# EasyEDA Pro project CameraSmartWatch.eprj

# Schematic Schematic1
Create Date: 2023-10-17; Page Name: P1; Project Name: CameraSmartWatch; Schematic Name: Schematic1; Update Date: 2023-11-03; Company: JoaoMiranda; Drawed: Ramiro Seliman; Page Size: A4; Part Number: PARTE 1; Reviewed: Ramiro Seliman; Version: V0.1
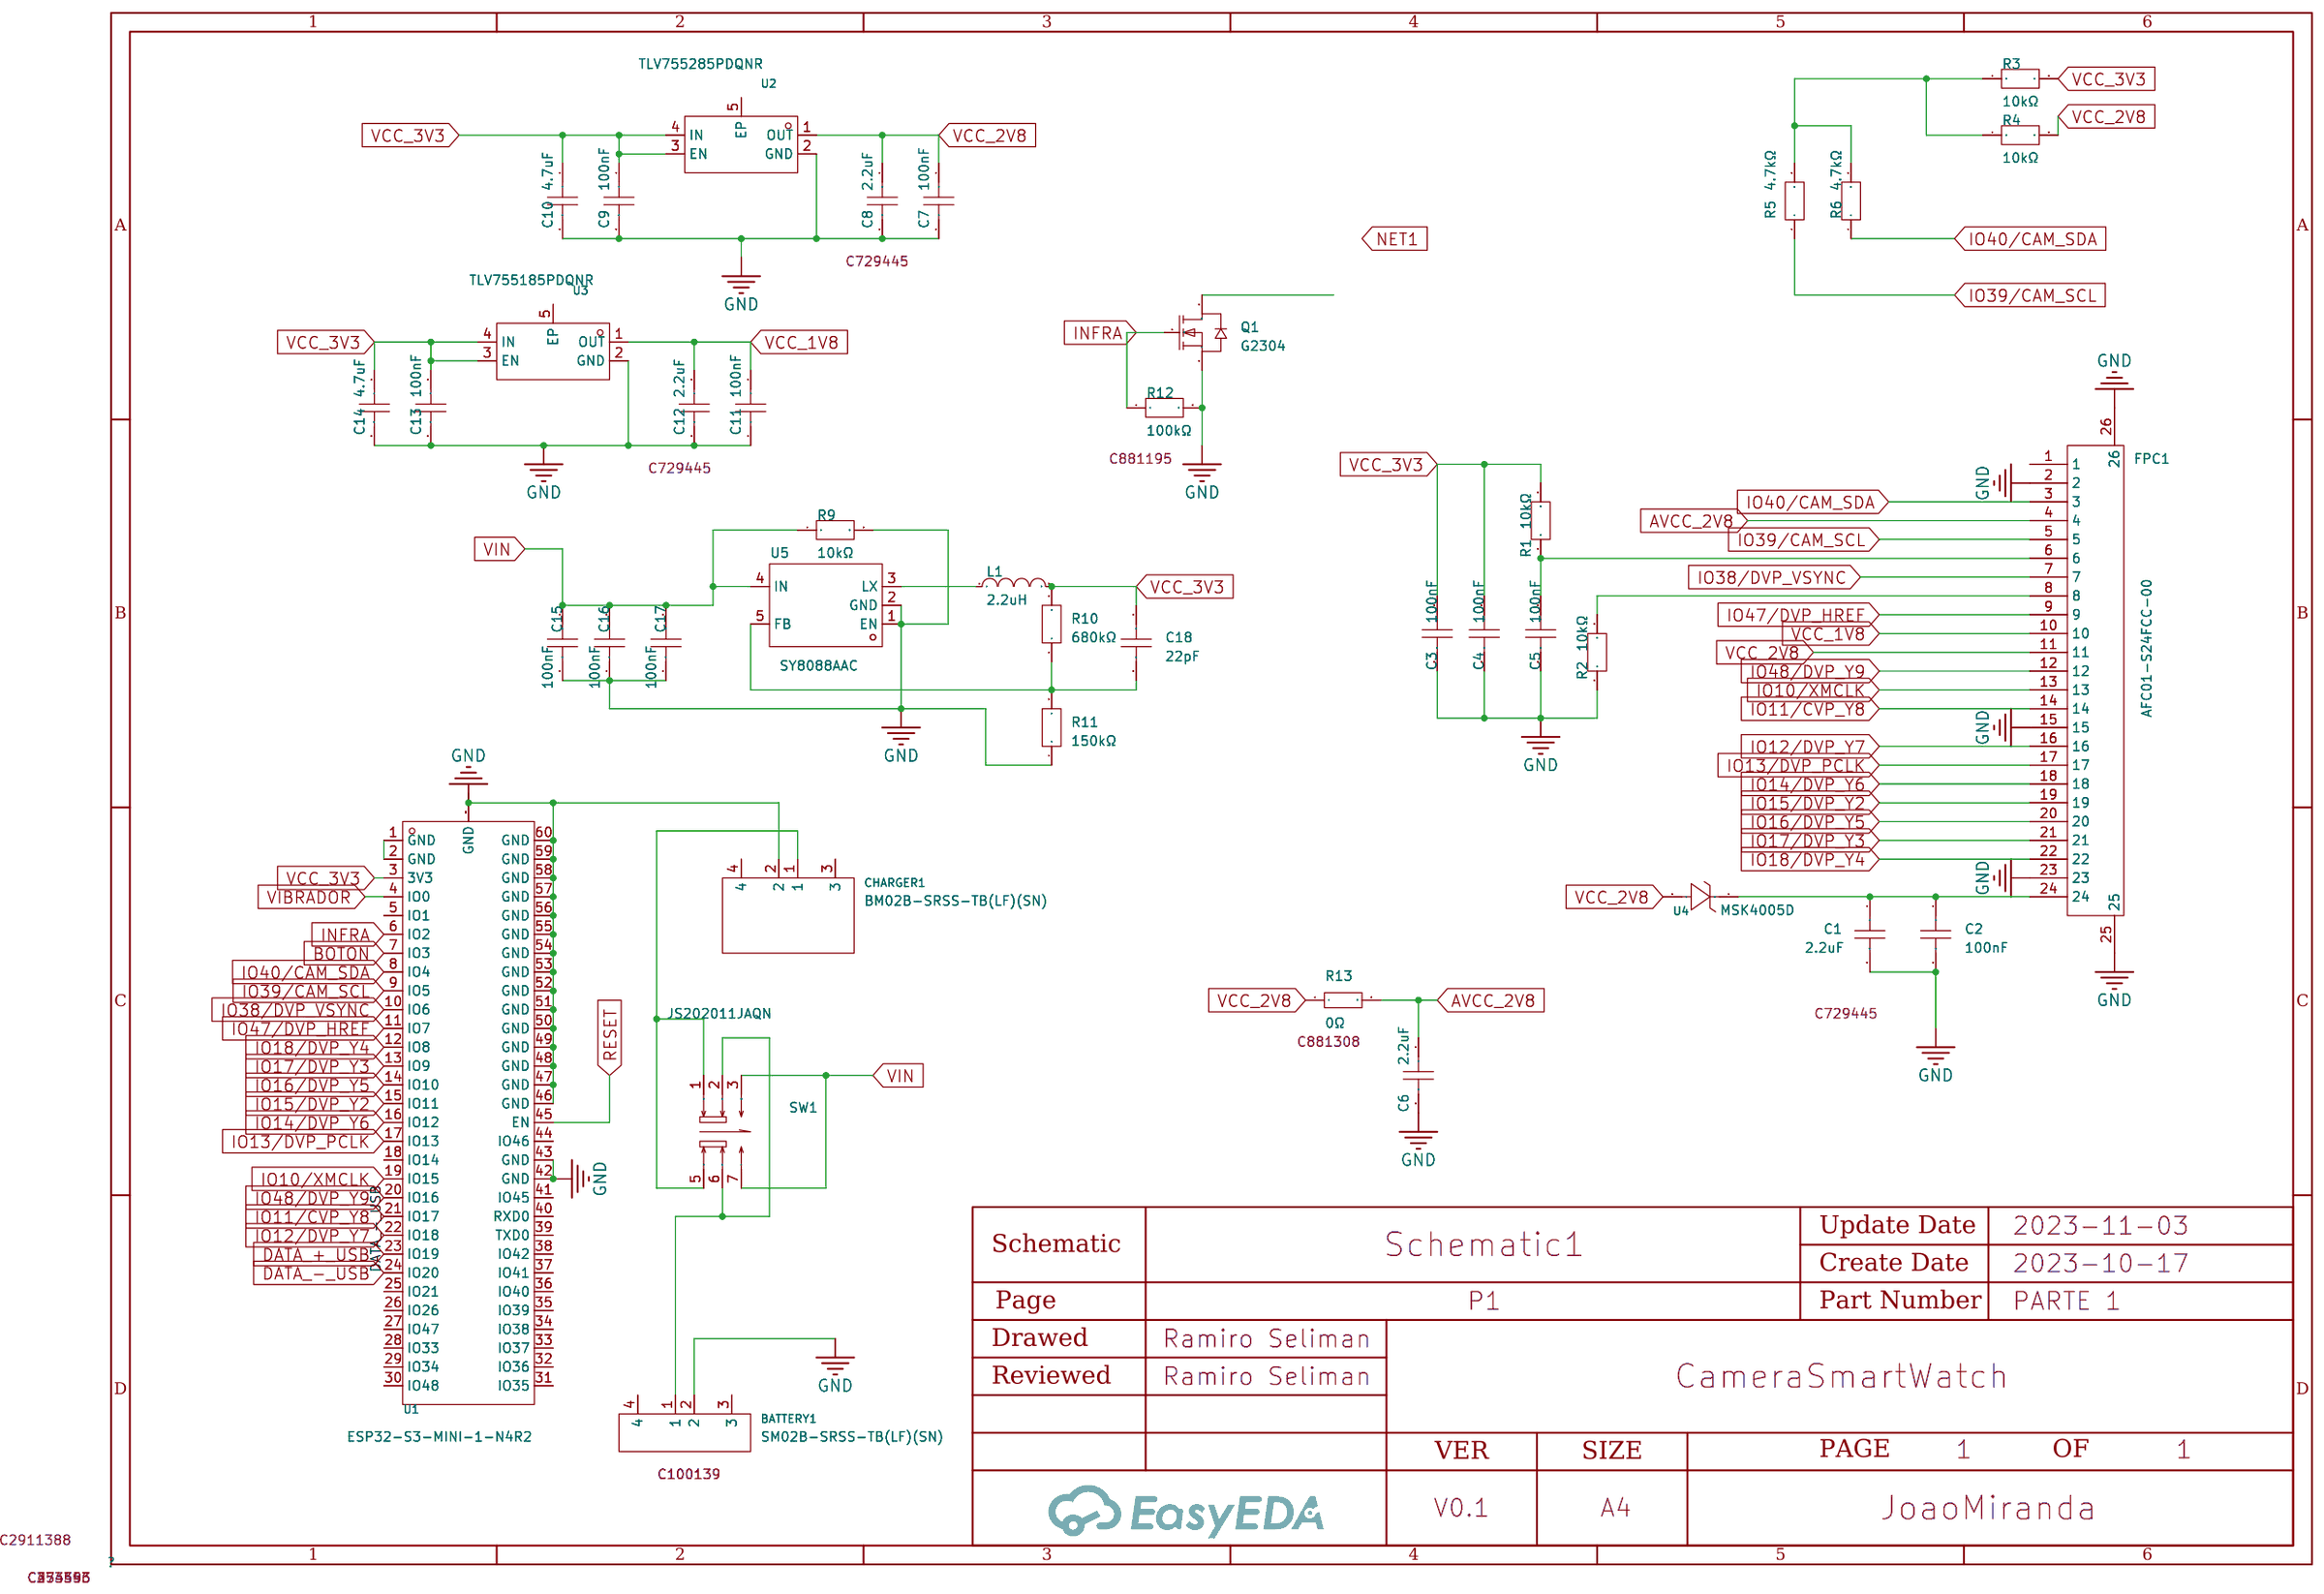
[diagram p0: schematic sheet]

## Parts
BATTERY1  SM02B-SRSS-TB(LF)(SN)  [CONN-SMD_2P-P1.00_SM02B-SRSS-TB-LF-SN]
C1  2.2uF  [C0201]
C2  100nF  [C0201]
C3  100nF  [C0201]
C4  100nF  [C0201]
C5  100nF  [C0201]
C6  2.2uF  [C0201]
C7  100nF  [C0201]
C8  2.2uF  [C0201]
C9  100nF  [C0201]
C10  4.7uF  [C0402]
C11  100nF  [C0201]
C12  2.2uF  [C0201]
C13  100nF  [C0201]
C14  4.7uF  [C0402]
C15  100nF  [C0201]
C16  100nF  [C0201]
C17  100nF  [C0201]
C18  22pF  [C0201]
CHARGER1  BM02B-SRSS-TB(LF)(SN)  [CONN-TH_BM02B-SRSS-TB-LF-SN]
FPC1  AFC01-S24FCC-00  [FPC-SMD_P0.5-24P_FGS-XJ-H2.0]
L1  2.2uH  [IND-SMD_L2.5-W2.0_YXNAQ2520XX]
Q1  G2304  [SOT-23-3_L2.9-W1.3-P1.90-LS2.4-BR]
R1  10kΩ  [R0201]
R2  10kΩ  [R0201]
R3  10kΩ  [R0201]
R4  10kΩ  [R0201]
R5  4.7kΩ  [R0201]
R6  4.7kΩ  [R0201]
R9  10kΩ  [R0201]
R10  680kΩ  [R0201]
R11  150kΩ  [R0201]
R12  100kΩ  [R0201]
R13  0Ω  [R0603]
SW1  JS202011JAQN  [SW-SMD_JS202011JAQN]
U1  ESP32-S3-MINI-1-N4R2  [BULETM-SMD_ESP32-S3-MINI-1-N8]
U2  TLV755285PDQNR  [X2SON-4_L1.0-W1.0-P0.65-TL-EP]
U3  TLV755185PDQNR  [X2SON-4_L1.0-W1.0-P0.65-TL-EP]
U4  MSK4005D  [SOD-882_L1.0-W0.6-RD]
U5  SY8088AAC  [SOT-23-5_L3.0-W1.7-P0.95-LS2.8-BR]

## Library data of the parts
BATTERY1 = SM02B-SRSS-TB(LF)(SN): Pitch:1mm Number of Rows:1 Mounting Style:Surface Mount Current Rating (Max):1A Contact Material:Copper Alloy Contact Plating:Tin Operating Temperature Range:-25℃~+85℃ Operating Temperature Range:-25℃~+85℃; LCSC Part Name: 间距:1mm 卧贴; Supplier Part: C160402; Manufacturer: JST; JLCPCB Part Class: Extended Part; Datasheet: https://atta.szlcsc.com/upload/public/pdf/source/20181010/C265335_7D2AD766CA0E20E745663C87507A223E.pdf; Supplier: LCSC; Pitch: 1mm; Number of Rows: 1; Mounting Style: Surface Mount; Current Rating (Max): 1A; Contact Material: Copper Alloy; Contact Plating: Tin; Operating Temperature Range: -25℃~+85℃
C1 C6 C8 C12 = C0201X5R225M100NT: Capacitance: Tolerance:±20% Tolerance:±20% Voltage Rated: Temperature Coefficient:; LCSC Part Name: 2.2uF ±20% 10V; Supplier Part: C729445; Manufacturer: SANYEAR(叁叶源); Supplier Footprint: 0201; JLCPCB Part Class: Extended Part; Datasheet: https://atta.szlcsc.com/upload/public/pdf/source/20200102/C475251_1E30ECAC0E8AE7254982658A02A2D78C.pdf; Supplier: LCSC; Tolerance: ±20%
C2-C5 C7 C9 C11 C13 C15-C17 = C0201B104K016TSF: Capacitance: Tolerance:±10% Tolerance:±10% Voltage Rated: Temperature Coefficient:; LCSC Part Name: 100nF ±10% 16V; Supplier Part: C559124; Manufacturer: IHHEC(禾伸堂); Supplier Footprint: 0201; JLCPCB Part Class: Extended Part; Datasheet: https://atta.szlcsc.com/upload/public/pdf/source/20200702/C559124_E602A2AD591ED344AFA764914E67FE0D.pdf; Supplier: LCSC; Tolerance: ±10%
C10 C14 = C0402X5R475M250NT: Capacitance: Voltage Rated: Temperature Coefficient:; LCSC Part Name: 4.7uF 25V; Supplier Part: C2911388; Manufacturer: SANYEAR(叁叶源); Supplier Footprint: 0402; JLCPCB Part Class: Extended Part; Datasheet: https://atta.szlcsc.com/upload/public/pdf/source/20210902/8F39E0658D363F48630A7672568BDC14.pdf; Supplier: LCSC; Check: true
C18 = CC0201FRNPO8BN220: Capacitance: Voltage Rated: Temperature Coefficient:; LCSC Part Name: 22pF 25V; Supplier Part: C541256; Manufacturer: YAGEO(国巨); Supplier Footprint: 0201; JLCPCB Part Class: Extended Part; Datasheet: https://atta.szlcsc.com/upload/public/pdf/source/20200615/C541256_B8D9E0562C8FB5CDBFC350BE07B53858.pdf; Supplier: LCSC
CHARGER1 = BM02B-SRSS-TB(LF)(SN): Pitch:1mm Number of Rows:1 Mounting Style:Surface Mount Current Rating (Max):1A Contact Material:Copper Alloy Contact Plating:Tin Operating Temperature Range:-25℃~+85℃ Operating Temperature Range:-25℃~+85℃; Supplier Part: C160388; Manufacturer: JST; Supplier Footprint: SMD,P=1mm; JLCPCB Part Class: Extended Part; Datasheet: https://atta.szlcsc.com/upload/public/pdf/source/20181008/C268118_5C0FE2784716D1E5DD0A36233D1E1F34.pdf; Supplier: LCSC; Pitch: 1mm; Number of Rows: 1; Mounting Style: Surface Mount; Current Rating (Max): 1A; Contact Material: Copper Alloy; Contact Plating: Tin; Operating Temperature Range: -25℃~+85℃
FPC1 = AFC01-S24FCC-00: Pitch:0.5mm Number of Contacts:24P Locking Feature:Clamshell Mounting Type:Surface Mount Contact Type:Bottom Contact Height Above Board:2mm FFC, FCB Thickness:0.3mm~0.3mm FFC, FCB Thickness:0.3mm~0.3mm; LCSC Part Name: 0.5mm P数:24P 翻盖式 下接; Supplier Part: C262276; Manufacturer: JS(钜硕电子); Supplier Footprint: SMD,P=0.5mm; JLCPCB Part Class: Extended Part; Datasheet: https://atta.szlcsc.com/upload/public/pdf/source/20190816/C413942_2A72D1AC756EAE17EEDF756A339D4500.pdf; Supplier: LCSC; Pitch: 0.5mm; Number of Contacts: 24P; Locking Feature: Clamshell; Mounting Type: Surface Mount; Contact Type: Bottom Contact; Height Above Board: 2mm; FFC, FCB Thickness: 0.3mm~0.3mm
L1 = CKCS252012-2.2uH/N: Inductance: Tolerance:±30% Tolerance:±30% Rated Current: DC Resistance (DCR):; LCSC Part Name: 2.2uH ±30% 1.15A 216mΩ; Supplier Part: C354553; Manufacturer: CENKER(岑科); Supplier Footprint: SMD; JLCPCB Part Class: Extended Part; Datasheet: https://atta.szlcsc.com/upload/public/pdf/source/20190115/C354553_DA469E714C0072E4D484EF553D127654.pdf; Supplier: LCSC; Tolerance: ±30%
Q1 = G2304: Type: Drain Source Voltage (Vdss): Continuous Drain Current (Id): Power Dissipation (Pd): Drain Source On Resistance (RDS(on)@Vgs,Id):58mΩ@10A,3.6A Gate Threshold Voltage (Vgs(th)@Id):2.2V@250uA; LCSC Part Name: N沟道 30V 3.6A; Supplier Part: C337503; Manufacturer: GOFORD(谷峰); Supplier Footprint: SOT-23; JLCPCB Part Class: Extended Part; Datasheet: https://atta.szlcsc.com/upload/public/pdf/source/20181128/C337503_FF6985BF364290258D92D50176B96B42.pdf; Supplier: LCSC; Drain Source On Resistance (RDS(on)@Vgs,Id): 58mΩ@10A,3.6A; Gate Threshold Voltage (Vgs(th)@Id): 2.2V@250uA
R1-R4 R9 = CR0201FH1002G: Type: Resistance: Tolerance:±1% Tolerance:±1% Power(Watts):- Overload Voltage (Max):-; LCSC Part Name: 10kΩ ±1%; Supplier Part: C100126; Manufacturer: LIZ(丽智电子); Supplier Footprint: 0201; JLCPCB Part Class: Extended Part; Datasheet: https://atta.szlcsc.com/upload/public/pdf/source/20170408/1491621348608.pdf; Supplier: LCSC; Tolerance: ±1%
R5 R6 = CR0201FH4701G: Type:Thick Film Resistors Resistance: Tolerance:±1% Tolerance:±1% Power(Watts): Temperature Coefficient:±250ppm/℃ Temperature Coefficient:±250ppm/℃ Overload Voltage (Max): Operating Temperature Range:-55℃~+125℃ Operating Temperature Range:-55℃~+125℃; LCSC Part Name: 4.7kΩ ±1% 50mW; Supplier Part: C100139; Manufacturer: LIZ(丽智电子); Supplier Footprint: 0201; JLCPCB Part Class: Extended Part; Datasheet: https://atta.szlcsc.com/upload/public/pdf/source/20170408/1491621352521.pdf; Supplier: LCSC; Type: Thick Film Resistors; Tolerance: ±1%; Temperature Coefficient: ±250ppm/℃; Operating Temperature Range: -55℃~+125℃
R10 = 0201WMF6803TEE: Type:Thick Film Resistors Resistance: Tolerance:±1% Tolerance:±1% Power(Watts): Temperature Coefficient:±200ppm/℃ Temperature Coefficient:±200ppm/℃ Overload Voltage (Max): Operating Temperature Range:-55℃~+155℃ Operating Temperature Range:-55℃~+155℃; LCSC Part Name: 680kΩ ±1% 50mW; Supplier Part: C473493; Manufacturer: UNI-ROYAL(厚声); Supplier Footprint: 0201; JLCPCB Part Class: Extended Part; Datasheet: https://atta.szlcsc.com/upload/public/pdf/source/20200306/C422600_1E6D84923E4A46A82E41ADD87F860B5C.pdf; Supplier: LCSC; Type: Thick Film Resistors; Tolerance: ±1%; Temperature Coefficient: ±200ppm/℃; Operating Temperature Range: -55℃~+155℃
R11 = RC0201FR-07150KL: Type:Thick Film Resistors Resistance: Tolerance:±1% Tolerance:±1% Power(Watts): Temperature Coefficient:±200ppm/℃ Temperature Coefficient:±200ppm/℃ Overload Voltage (Max): Operating Temperature Range:-55℃~+125℃ Operating Temperature Range:-55℃~+125℃; LCSC Part Name: 厚膜电阻 150kΩ ±1% 50mW; Supplier Part: C274346; Manufacturer: YAGEO(国巨); Supplier Footprint: 0201; JLCPCB Part Class: Extended Part; Datasheet: https://atta.szlcsc.com/upload/public/pdf/source/20180821/C275644_0D56F95EFF785E7D9A1FEF436B37DA78.pdf; Supplier: LCSC; Type: Thick Film Resistors; Tolerance: ±1%; Temperature Coefficient: ±200ppm/℃; Operating Temperature Range: -55℃~+125℃
R12 = CR0201J100KQ15Z: Resistance: Tolerance:±5% Tolerance:±5% Power(Watts): Temperature Coefficient:±200ppm/℃ Temperature Coefficient:±200ppm/℃; LCSC Part Name: 100kΩ ±5% 50mW; Supplier Part: C881195; Manufacturer: EVER OHMS(天二科技); Supplier Footprint: 0201; JLCPCB Part Class: Extended Part; Datasheet: https://atta.szlcsc.com/upload/public/pdf/source/20201014/C881429_ABC29D63C8D6A11EB63D87348B25AA7B.pdf; Supplier: LCSC; Tolerance: ±5%; Temperature Coefficient: ±200ppm/℃
R13 = CR0603F0R00P05Z: Resistance: Tolerance:±1% Tolerance:±1% Power(Watts):; LCSC Part Name: 0Ω ±1% 100mW; Supplier Part: C881308; Manufacturer: EVER OHMS(天二科技); Supplier Footprint: 0603; JLCPCB Part Class: Extended Part; Datasheet: https://atta.szlcsc.com/upload/public/pdf/source/20201014/C881429_ABC29D63C8D6A11EB63D87348B25AA7B.pdf; Supplier: LCSC; Tolerance: ±1%
SW1 = JS202011JAQN: Current Rating (DC):300mA Voltage Rating (DC):6V Current Rating (AC):- Voltage Rating (AC):- Circuit:DPDT Mounting Style:Surface Mount Mechanical Life:5000 Actuator Style:Rectangular columnar Pin Style:J pin Operating Temperature:-40℃~+85℃ Operating Tempe; Supplier Part: C221664; Manufacturer: C&K; Supplier Footprint: SMD; JLCPCB Part Class: Extended Part; Datasheet: https://atta.szlcsc.com/upload/public/pdf/source/20180724/C221664_88647708B2CCDCC34936E1CD4FA56A87.pdf; Supplier: LCSC; Current Rating (DC): 300mA; Voltage Rating (DC): 6V; Circuit: DPDT; Mounting Style: Surface Mount; Mechanical Life: 5000; Actuator Style: Rectangular columnar; Pin Style: J pin; Operating Temperature: -40℃~+85℃
U1 = ESP32-S3-MINI-1-N4R2: Supplier Part: C3013941; Manufacturer: ESPRESSIF(乐鑫); Supplier Footprint: SMD; JLCPCB Part Class: Extended Part; Supplier: LCSC
U2 = SGM2036S-2.8XXDH4G/TR: Supplier Part: C2860936; Manufacturer: TI(德州仪器); Supplier Footprint: XTDFN-4L(1x1); Datasheet: https://atta.szlcsc.com/upload/public/pdf/source/20220622/ACAD10DFD97B58DF70C689B3412109D4.pdf; Supplier: LCSC
U3 = TLV755185PDQNR: Supplier Part: C2860936; Manufacturer: TI(德州仪器); Supplier Footprint: X2-SON-4-EP(1x1); JLCPCB Part Class: Extended Part; Datasheet: https://atta.szlcsc.com/upload/public/pdf/source/20230221/8E16F3B2F32D2FF7008DD79494891D4F.pdf; Supplier: LCSC
U4 = MSK4005D: Diode Configuration:Single Reverse Voltage (Vr):40V Average Rectified Current (Io):0.5A Forward Voltage (Vf@If):0.52V Reverse Leakage Current (Ir):50uA; LCSC Part Name: 40V 500mA 520mV; Supplier Part: C5160066; Manufacturer: SHIKUES(时科); Supplier Footprint: SOD-882; JLCPCB Part Class: Extended Part; Datasheet: https://atta.szlcsc.com/upload/public/pdf/source/20220908/AAA04C124F860CBF6FF51CBCA68291D9.pdf; Supplier: LCSC; Diode Configuration: Single; Reverse Voltage (Vr): 40V; Average Rectified Current (Io): 0.5A; Forward Voltage (Vf@If): 0.52V; Reverse Leakage Current (Ir): 50uA
U5 = SY8088AAC: Function:Step-down type Synchronous Rectification:- Number of Outputs:- Topology:- Input Voltage:- Input Voltage:- Output Current (Max):- Switching Frequency:-; LCSC Part Name: 降压型; Supplier Part: C79313; Manufacturer: silergy(矽力杰); Supplier Footprint: SOT-23-5; JLCPCB Part Class: Extended Part; Datasheet: https://atta.szlcsc.com/upload/public/pdf/source/20170329/1490752163260.pdf; Supplier: LCSC; Function: Step-down type

## Nets
AVCC_2V8: C6.1 FPC1.4 R13.2
GND: BATTERY1.2 C1.2 C2.2 C3.2 C4.2 C5.2 C6.2 C7.2 C8.2 C9.2 C10.2 C11.2 C12.2 C13.2 C14.2 C15.2 C16.1 C17.1 CHARGER1.2 FPC1.2 FPC1.15 FPC1.23 FPC1.25 FPC1.26 Q1.2(S) R2.1 R9.2 R11.1 R12.2 U1.42(GND) U1.43(GND) U1.46(GND) U1.47(GND) U1.48(GND) U1.49(GND) U1.50(GND) U1.51(GND) U1.52(GND) U1.53(GND) U1.54(GND) U1.55(GND) U1.56(GND) U1.57(GND) U1.58(GND) U1.59(GND) U1.60(GND) U1.GND U2.2(GND) U3.2(GND) U5.1(EN) U5.2(GND)
VCC_1V8: C11.1 C12.1 FPC1.10 U3.1(OUT)
VCC_2V8: C7.1 C8.1 FPC1.11 R4.2 R13.1 U2.1(OUT) U4.2(A)
VCC_3V3: C3.1 C4.1 C9.1 C10.1 C13.1 C14.1 C18.1 L1.2 R1.2 R3.2 R10.2 U1.3(3V3) U2.3(EN) U2.4(IN) U3.3(EN) U3.4(IN)
VIN: C15.1 C16.2 C17.2 R9.1 SW1.3 SW1.7 U5.4(IN)
BOTON: U1.7(IO3)
DATA_+_USB: U1.23(IO19)
DATA_-_USB: U1.24(IO20)
INFRA: Q1.1(G) R12.1 U1.6(IO2)
IO10/XMCLK: FPC1.13 U1.19(IO15)
IO11/CVP_Y8: FPC1.14 U1.21(IO17)
IO12/DVP_Y7: FPC1.16 U1.22(IO18)
IO13/DVP_PCLK: FPC1.17 U1.17(IO13)
IO14/DVP_Y6: FPC1.18 U1.16(IO12)
IO15/DVP_Y2: FPC1.19 U1.15(IO11)
IO16/DVP_Y5: FPC1.20 U1.14(IO10)
IO17/DVP_Y3: FPC1.21 U1.13(IO9)
IO18/DVP_Y4: FPC1.22 U1.12(IO8)
IO38/DVP_VSYNC: FPC1.7 U1.10(IO6)
IO39/CAM_SCL: FPC1.5 R5.1 U1.9(IO5)
IO40/CAM_SDA: FPC1.3 R6.1 U1.8(IO4)
IO47/DVP_HREF: FPC1.9 U1.11(IO7)
IO48/DVP_Y9: FPC1.12 U1.20(IO16)
RESET: U1.45(EN)
VIBRADOR: U1.4(IO0)
$1N1431: C1.1 C2.1 FPC1.24 U4.1(K)
$1N1711: C5.1 FPC1.6 R1.1
$1N1779: FPC1.8 R2.2
$1N2040: R3.1 R4.1 R5.2 R6.2
$1N3684: U1.1(GND) U1.2(GND)
$1N9477: BATTERY1.1 SW1.2 SW1.6
$1N11625: L1.1 U5.3(LX)
$1N11783: C18.2 R10.1 R11.2 U5.5(FB)
$1N23339: CHARGER1.1 SW1.1 SW1.5

Not connected (* = marked no-connect by the designer): BATTERY1 3 4; CHARGER1 3 4; FPC1 1; Q1 3(D); U1 5(IO1) 18(IO14) 25(IO21) 26(IO26) 27(IO47) 28(IO33) 29(IO34) 30(IO48) 31(IO35) 32(IO36) 33(IO37) 34(IO38) 35(IO39) 36(IO40) 37(IO41) 38(IO42) 39(TXD0) 40(RXD0) 41(IO45) 44(IO46); U2 5(EP); U3 5(EP)

# Board PCB1
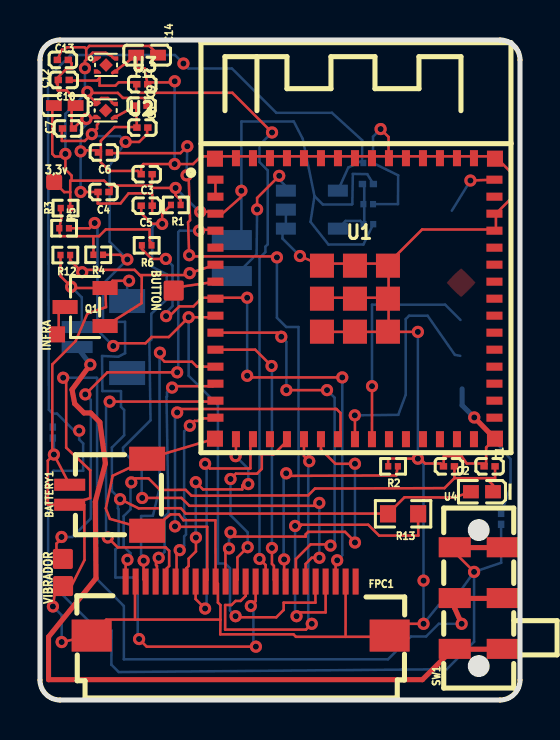
[diagram p1: board, top side]
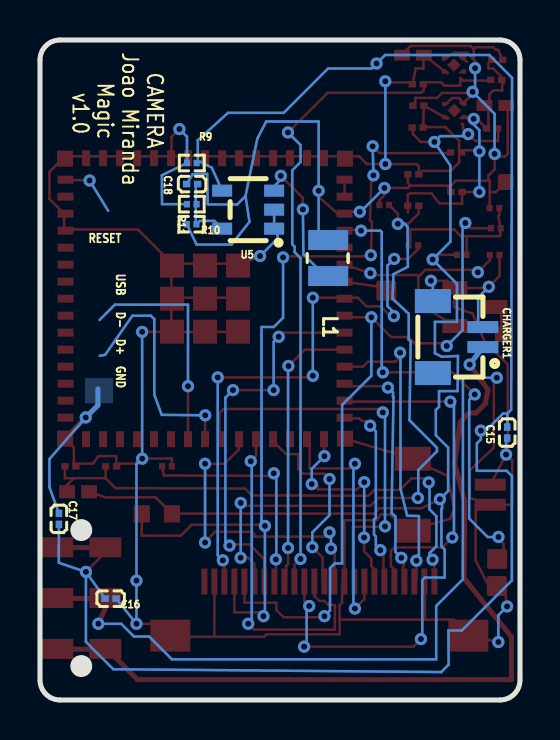
[diagram p2: board, bottom side, seen from below]

Outline 24 x 33 mm; copper layers: Top Layer, Bottom Layer. Coordinates in mm from the lower left corner of the outline.
Outline path: 0,32 0,1 arc(0.29,0.29) 1,0 23,0 arc(23.71,0.29) 24,1 24,32 arc(23.71,32.71) 23,33 1,33 arc(0.29,32.71) 0,32
Stack: Top Layer 0.035mm / Dielectric1 1.51mm FR4 er 4.5 / Bottom Layer 0.035mm

## Design rules (mm)
template: Custom Config
spacing copperThickness1oz (default): track to track 0.102, other pairs 0.152 to 0.3
spacing copperThickness2oz: track to track 0.203, other pairs 0.152 to 0.3
track width copperThickness1oz (default): min 0.127, default 0.127, max 2.54
track width copperThickness2oz: min 0.203, default 0.254, max 2.54
differential pair differentialPair (default): width min 0.127, default 0.254, max 2.54; gap min 0.152, default 0.152
via viaSize (default): diameter min 0.5, default 0.61, max 10; hole min 0.3, default 0.305, max 6.3

## Placement (name value [footprint] x y rotation side)
BATTERY1  SM02B-SRSS-TB(LF)(SN)  [CONN-SMD_2P-P1.00_SM02B-SRSS-TB-LF-SN]  3.42 10.26 90 top
C1  2.2uF  [C0201]  22.48 11.68 180 top
C2  100nF  [C0201]  20.45 11.68 180 top
C3  100nF  [C0201]  5.33 26.29 180 top
C4  100nF  [C0201]  3.18 25.4 180 top
C5  100nF  [C0201]  5.34 24.71 0 top
C6  2.2uF  [C0201]  3.19 27.38 180 top
C7  100nF  [C0201]  1.4 28.58 0 top
C8  2.2uF  [C0201]  5.12 28.62 180 top
C9  100nF  [C0201]  5.08 29.72 180 top
C10  4.7uF  [C0402]  1.24 29.72 0 top
C11  100nF  [C0201]  5.11 30.79 0 top
C12  2.2uF  [C0201]  1.19 31 180 top
C13  100nF  [C0201]  1.14 32 0 top
C14  4.7uF  [C0402]  5.36 32.24 180 top
C15  100nF  [C0201]  0.64 13.37 270 bottom
C16  100nF  [C0201]  20.47 5.07 0 bottom
C17  100nF  [C0201]  23.05 9.06 270 bottom
C18  22pF  [C0201]  16.4 25.8 180 bottom
CHARGER1  BM02B-SRSS-TB(LF)(SN)  [CONN-TH_BM02B-SRSS-TB-LF-SN]  3.11 18.15 270 bottom
FPC1  AFC01-S24FCC-00  [FPC-SMD_P0.5-24P_FGS-XJ-H2.0]  10.03 4.57 180 top
L1  2.2uH  [IND-SMD_L2.5-W2.0_YXNAQ2520XX]  9.59 22.1 90 bottom
NOREF  -  [Pad_e154]  0.71 25.9 90 top
NOREF#2  -  [Pad_e1959]  6.68 20.47 0 top
NOREF#3  -  [Pad_e140]  0.85 18.28 90 top
NOREF#4  -  [Pad_e155]  1.16 5.7 270 top
NOREF#5  -  [Pad_e158]  1.14 7.05 270 top
Q1  G2304  [sot-23-3_l2.9-w1.3-p1.90-ls2.4-br]  2.25 19.65 0 top
R1  10kΩ  [R0201]  6.79 24.75 0 top
R2  10kΩ  [R0201]  17.65 11.68 0 top
R3  10kΩ  [R0201]  1.28 24.59 0 top
R4  10kΩ  [R0201]  2.91 22.26 0 top
R5  4.7kΩ  [R0201]  1.21 23.59 180 top
R6  4.7kΩ  [R0201]  5.33 22.73 0 top
R9  10kΩ  [R0201]  16.41 26.85 0 bottom
R10  680kΩ  [R0201]  16.42 23.79 0 bottom
R11  150kΩ  [R0201]  16.41 24.79 180 bottom
R12  100kΩ  [R0201]  1.27 22.25 180 top
R13  0Ω  [R0603]  18.16 9.31 0 top
SW1  JS202011JAQN  [SW-SMD_JS202011JAQN]  21.94 5.1 90 top
U1  ESP32-S3-MINI-1-N4R2  [BULETM-SMD_ESP32-S3-MINI-1-N8]  15.75 20.07 0 top
U2  TLV755285PDQNR  [X2SON-4_L1.0-W1.0-P0.65-TL-EP]  3.28 29.47 0 top
U3  TLV755185PDQNR  [X2SON-4_L1.0-W1.0-P0.65-TL-EP]  3.3 31.75 0 top
U4  MSK4005D  [SOD-882_L1.0-W0.6-RD]  22.1 10.41 180 top
U5  SY8088AAC  [SOT-23-5_L3.0-W1.7-P0.95-LS2.8-BR]  13.59 24.52 180 bottom

## Footprints (pads in the part's own frame, mm; a bottom-side part is the same pattern mirrored in y, then rotated)
BULETM-SMD_ESP32-S3-MINI-1-N8
  rect 0.8x0.4 smd: 1(-6.975,5.95) 2(-6.975,5.1) 3(-6.975,4.25) 4(-6.975,3.4) 5(-6.975,2.55) 6(-6.975,1.7) 7(-6.975,0.85) 8(-6.975,0) 9(-6.975,-0.85) 10(-6.975,-1.7) 11(-6.975,-2.55) 12(-6.975,-3.4) 13(-6.975,-4.25) 14(-6.975,-5.1) 15(-6.975,-5.95) 31(6.975,-5.95) 32(6.975,-5.1) 33(6.975,-4.25) 34(6.975,-3.4) 35(6.975,-2.55) 36(6.975,-1.7) 37(6.975,-0.85) 38(6.975,0) 39(6.975,0.85) 40(6.975,1.7) 41(6.975,2.55) 42(6.975,3.4) 43(6.975,4.25) 44(6.975,5.1) 45(6.975,5.95)
  rect 0.4x0.8 smd: 16(-5.95,-7.025) 17(-5.1,-7.025) 18(-4.25,-7.025) 19(-3.4,-7.025) 20(-2.55,-7.025) 21(-1.7,-7.025) 22(-0.85,-7.025) 23(0,-7.025) 24(0.85,-7.025) 25(1.7,-7.025) 26(2.55,-7.025) 27(3.4,-7.025) 28(4.25,-7.025) 29(5.1,-7.025) 30(5.95,-7.025) 46(5.95,7.025) 47(5.1,7.025) 48(4.25,7.025) 49(3.4,7.025) 50(2.55,7.025) 51(1.7,7.025) 52(0.85,7.025) 53(0,7.025) 54(-0.85,7.025) 55(-1.7,7.025) 56(-2.55,7.025) 57(-3.4,7.025) 58(-4.25,7.025) 59(-5.1,7.025) 60(-5.95,7.025)
  rect 0.8x0.8 smd: GND(-7,7) GND(-7,-7) GND(7,7) GND(7,-7)
  rect 1.2x1.2 smd: GND(-1.65,1.65) GND(-1.65,0) GND(-1.65,-1.65) GND(0,1.65) GND(0,0) GND(0,-1.65) GND(1.65,1.65) GND(1.65,0) GND(1.65,-1.65)
C0201
  rect 0.368x0.324 smd: 1(-0.275,0) 2(0.275,0)
C0402
  rect 0.79x0.54 smd: 1(-0.545,0) 2(0.545,0)
CONN-SMD_2P-P1.00_SM02B-SRSS-TB-LF-SN
  rect 0.6x1.55 smd: 1(-0.5,1.938) 2(0.5,1.938)
  rect 1.2x1.8 smd: 3(1.8,-1.938) 4(-1.8,-1.938)
CONN-TH_BM02B-SRSS-TB-LF-SN
  rect 0.6x1.55 smd: 1(0.502,1.25) 2(-0.498,1.25)
  rect 1.2x1.8 smd: 3(1.8,-1.25) 4(-1.8,-1.25)
FPC-SMD_P0.5-24P_FGS-XJ-H2.0
  rect 0.3x1.3 smd: 1(-5.748,-1.351) 2(-5.248,-1.351) 3(-4.748,-1.351) 4(-4.248,-1.351) 5(-3.748,-1.351) 6(-3.248,-1.351) 7(-2.748,-1.351) 8(-2.248,-1.351) 9(-1.748,-1.351) 10(-1.248,-1.351) 11(-0.748,-1.351) 12(-0.248,-1.351) 13(0.252,-1.351) 14(0.752,-1.351) 15(1.252,-1.351) 16(1.752,-1.351) 17(2.252,-1.351) 18(2.752,-1.351) 19(3.252,-1.351) 20(3.752,-1.351) 21(4.252,-1.351) 22(4.752,-1.351) 23(5.252,-1.351) 24(5.752,-1.351)
  rect 2x1.6 smd: 25(7.45,1.351) 26(-7.45,1.351)
IND-SMD_L2.5-W2.0_YXNAQ2520XX
  rect 1x2 smd: 1(-0.9,0) 2(0.9,0)
Pad_e140
  rect 0.8x0.8 smd: 1(0,0)
Pad_e154
  rrect 0.8x0.8 smd: 2(0,0)
Pad_e155
  rrect 1x1 smd: 1(0,0)
Pad_e158
  rrect 1x1 smd: 2(0,0)
Pad_e1959
  rrect 1x1 smd: 1(0,0)
R0201
  rect 0.303x0.324 smd: 1(-0.241,0) 2(0.241,0)
R0603
  rect 0.806x0.864 smd: 1(-0.753,0) 2(0.753,0)
SOD-882_L1.0-W0.6-RD
  rect 0.79x0.661 smd: 1(-0.551,0) 2(0.551,0)
sot-23-3_l2.9-w1.3-p1.90-ls2.4-br
  rect 1.25x0.7 smd: 1(1,-0.95) 2(1,0.95) 3(-1,0)
SOT-23-5_L3.0-W1.7-P0.95-LS2.8-BR
  rect 1x0.6 smd: 1(1.3,-0.95) 2(1.3,0) 3(1.3,0.95) 4(-1.3,0.95) 5(-1.3,-0.95)
SW-SMD_JS202011JAQN
  rect 1x1.6 smd: 1(-2.54,1.2) 2(0,1.2) 3(2.54,1.2) 5(-2.54,-1.2) 6(0,-1.2) 7(2.54,-1.2)
X2SON-4_L1.0-W1.0-P0.65-TL-EP
  custom 0.36x0.22 smd: 1(-0.43,0.325) 2(-0.43,-0.325) 3(0.43,-0.325) 4(0.43,0.325)
  rect 0.48x0.48 smd rot 45: 5(0,0)

## Nets
As in the schematic, except:
GND: BATTERY1.2 C1.2 C2.2 C3.2 C4.2 C5.2 C6.2 C7.2 C8.2 C9.2 C10.2 C11.2 C12.2 C13.2 C14.2 C15.2 C16.1 C17.1 CHARGER1.2 FPC1.2 FPC1.15 FPC1.23 FPC1.25 FPC1.26 NOREF#4.1 Q1.2 R2.1 R9.2 R11.1 R12.2 U1.42 U1.43 U1.46 U1.47 U1.48 U1.49 U1.50 U1.51 U1.52 U1.53 U1.54 U1.55 U1.56 U1.57 U1.58 U1.59 U1.60 U1.GND U2.2 U3.2 U5.1 U5.2
VCC_3V3: C3.1 C4.1 C9.1 C10.1 C13.1 C14.1 C18.1 L1.2 NOREF.2 R1.2 R3.2 R10.2 U1.3 U2.3 U2.4 U3.3 U3.4
BOTON: NOREF#2.1 U1.7
VIBRADOR: NOREF#5.2 U1.4
$1N15264: NOREF#3.1 Q1.3

Pads without a net: BATTERY1 3 4; CHARGER1 3 4; FPC1 1; U1 5 18 25 26 27 28 29 30 31 32 33 34 35 36 37 38 39 40 41 44; U2 5; U3 5

## Via types
v1: diameter 0.61, hole 0.305, Top Layer to Bottom Layer, 103 vias

## Routing (per net, layer and track width the routed paths; a pad name or vN(x,y) marks a point on that pad's centre or on a via; arc(x,y) is an arc through that point)
AVCC_2V8: length 43.5
  Top Layer w0.127: v1(12.83,4.19) 13.02,4.38 14.28,4.38 FPC1.4 ; v1(11.85,22.13) 11.79,22.18 7.52,22.18 v1(7.46,22.24) 7.4,23.89 7.5,23.99 7.43,26.13 v1(7.33,26.23) ; v1(12.75,8.7) 13.02,8.7 13.08,8.76 16.41,8.76 16.96,8.22 18.92,8.22 18.9,9.31 ; C6.1 3.5,27.34 7.02,27.34 v1(7.37,27.69) ; 18.9,9.31 R13.2
  Bottom Layer w0.127: v1(12.83,4.19) 12.75,4.26 v1(12.75,8.7) 12.92,8.87 12.92,18.65 12.31,18.65 11.85,19.11 v1(11.85,22.13) ; v1(7.33,26.23) v1(7.37,27.69)
GND: length 199.8
  Top Layer w0.127: U1.49 19.15,27.18 ; 19.15,27.18 18.3,27.18 ; 19.15,27.18 20,27.18 ; 8.75,27.18 8.04,27.18 7.65,26.8 v1(6.73,26.8) 5.16,26.8 5.06,26.69 C3.2 4.9,26.45 3.47,26.45 3.04,26.88 3.04,27.43 ; 8.75,27.18 9.8,27.18 ; 8.75,27.18 U1.GND ; 15.75,18.41 U1.GND ; 15.75,18.41 17.4,18.41 ; 15.75,18.41 14.11,18.41 U1.GND ; 3.04,27.43 3.04,27.96 3.73,28.65 4.73,28.65 4.81,28.58 ; 3.04,27.43 2.9,27.43 ; 22.75,27.18 21.7,27.18 ; 22.75,27.18 U1.GND ; 22.75,27.18 23.53,26.41 23.53,25.05 22.8,24.32 ; 21.7,27.18 20.85,27.18 ; 21.7,27.18 U1.46 ; C8.2 C9.2 3.61,29.06 ; U1.52 16.6,27.18 ; 16.6,27.18 17.43,27.18 ; 16.6,27.18 15.75,27.18 ; 4.75,4.02 3.31,4.02 2.58,3.29 2.58,3.22 v1(1.08,2.9) ; 4.75,4.02 9.02,4.02 ; 4.75,4.02 4.75,5.89 FPC1.23 ; 17.4,21.82 19.11,23.53 22.8,23.53 ; 17.4,21.82 U1.GND 17.43,21.68 17.43,20.07 ; 17.4,21.82 15.75,21.82 ; FPC1.2 15.28,3.16 ; 15.28,3.16 12.8,3.16 12.68,3.28 9.01,3.28 9.02,4.02 ; 15.28,3.16 17.36,3.16 17.48,3.29 ; 9.8,27.18 10.65,27.18 ; 9.8,27.18 U1.60 ; 14.05,27.18 13.2,27.18 ; 14.05,27.18 14.9,27.18 ; 14.05,27.18 U1.55 ; 13.2,27.18 U1.56 13.19,26.93 13.15,26.93 ; 13.2,27.18 12.35,27.18 ; 17.4,18.41 U1.GND 17.43,18.45 17.43,20.07 ; 17.4,18.41 v1(18.89,18.41) ; U1.GND 5.57,12.13 3.63,11.21 3.29,9.58 3.5,9.06 5.53,8.48 6.52,9.28 6.95,9.28 7.17,8.99 8.77,8.99 FPC1.15 8.9,5.81 8.9,4.87 9.02,4.75 9.02,4.02 ; 22.8,24.32 U1.43 ; 22.8,24.32 22.8,23.53 ; 14.9,27.18 15.75,27.18 ; 14.9,27.18 U1.54 ; 20.85,27.18 20,27.18 ; 20.85,27.18 U1.47 ; 17.48,3.29 FPC1.26 ; 17.48,3.29 18.01,3.81 v1(19.18,3.81) ; 0.87,30.8 0.89,30.78 0.89,30.48 1.33,30.48 1.53,30.28 1.53,29.88 1.69,29.72 1.58,29.61 1.58,28.67 C7.2 2.15,29.05 v1(2.32,29.05) U2.2 ; U1.48 20,27.18 ; 2.9,27.43 2.9,27.43 ; 2.9,27.43 2.84,27.49 2.09,27.49 v1(2.03,27.43) ; 4.45,20.96 3.63,20.96 3.27,20.6 ; 17.43,27.18 U1.51 17.45,27.18 ; 17.43,27.18 17.45,27.18 ; 17.43,27.18 17.43,28.15 v1(17.03,28.55) ; 10.65,27.18 11.5,27.18 ; 10.65,27.18 U1.59 ; v1(0.7,12.27) 0.61,12.36 0.61,16.78 1.78,17.95 2.37,19.32 3.3,19.65 3.26,20.59 3.27,20.6 ; v1(0.7,12.27) BATTERY1.2 ; v1(0.7,12.27) 0.39,11.97 0.39,9.76 2.21,9.76 2.23,7 1.59,5.73 1.16,5.73 1.16,5.72 0.8,5.72 v1(0.65,4.68) ; U1.GND 22.31,12.63 22.31,11.82 ; 17.43,20.07 U1.GND 17.35,20.11 15.75,20.11 ; 3.27,20.6 2.73,20.6 ; 3.27,20.6 3.19,20.54 2.73,20.6 ; 18.3,27.18 U1.50 ; 18.3,27.18 17.45,27.18 ; 15.75,27.18 U1.53 ; v1(6.74,30.94) 6.68,30.88 5.36,30.88 5.24,31.42 5.24,31.57 4.83,31.57 4.83,32.23 C14.2 3.63,31.34 ; 0.84,30.8 0.84,31.08 1.34,31.57 1.58,31.57 1.58,31.84 C13.2 ; U1.58 11.5,27.18 ; 11.5,27.18 12.35,27.18 ; 5.61,24.38 5.61,24.71 5.61,25.29 5.48,25.34 4.43,25.33 4.03,24.83 2.89,24.82 C4.2 v1(2.03,25.4) ; 22.8,23.53 22.73,23.47 U1.42 ; R2.1 17.4,12.07 19.02,12.07 ; U1.GND 15.75,21.82 ; 15.75,21.82 14.2,21.82 U1.GND v1(13,22.2) ; 2.73,20.6 1.62,20.6 v1(1.56,20.66) 1.02,21.19 R12.2 ; 19.02,12.07 19.26,11.82 20.03,11.82 C2.2 20.19,12.19 21.08,12.19 21.34,11.82 22.31,11.82 ; 19.02,12.07 v1(18.89,12.07) ; 22.31,11.82 22.31,11.79 C1.2 ; 15.75,20.11 U1.GND ; 15.75,20.11 14.14,20.11 U1.GND ; U1.57 12.35,27.18
  Top Layer w0.254: v1(21.71,14.13) U1.GND
  Bottom Layer w0.127: R11.1 17.9,24.79 17.91,26.23 R9.2 16.65,28.17 v1(17.03,28.55) ; CHARGER1.2 2.09,18.88 2.09,20.13 v1(1.56,20.66) ; 4.36,19.95 4.36,20.86 v1(4.45,20.96) ; v1(0.65,4.68) 1.08,4.24 v1(1.08,2.9) ; 0.64,13.1 0.63,13.1 0.7,13.03 v1(0.7,12.27) ; v1(21.71,14.13) 23.53,12.05 23.53,10.64 C17.1 ; v1(18.89,18.41) v1(18.89,12.07) 19.18,11.78 v1(19.18,5.97) v1(19.18,3.81) C16.1 ; v1(2.32,29.05) 2.32,28.78 2.03,28.49 v1(2.03,27.43) v1(2.03,25.4) ; U5.2 U5.1 12.12,23.74 12.12,23.07 v1(13,22.2) ; v1(6.74,30.94) 6.73,30.93 v1(6.73,26.8)
  Bottom Layer w0.254: 21.11,15.55 21.11,14.74 v1(21.71,14.13)
VCC_1V8: length 35.4
  Top Layer w0.127: 4.81,30.84 4.77,30.88 3.94,30.88 3.77,30.72 2.98,30.72 2.98,31.1 2.85,30.97 1.49,30.97 C12.1 ; 4.81,30.84 4.81,30.86 ; 4.81,30.84 4.81,30.49 4.93,30.36 9.62,30.36 v1(11.6,28.38) ; v1(10.98,7.05) 11.28,6.75 FPC1.10 ; U3.1 2.66,31.91
  Bottom Layer w0.127: v1(10.98,7.05) 10.97,7.06 10.97,22.1 11.27,22.39 11.27,22.67 11.39,22.79 11.39,26.48 10.97,26.9 10.97,27.75 v1(11.6,28.38)
VCC_2V8: length 66.1
  Top Layer w0.127: FPC1.11 10.78,4.94 v1(10.54,4.7) ; v1(4.95,3.05) 5.33,2.67 v1(10.8,2.67) ; v1(4.37,22.03) 4.25,22.03 4.02,22.26 R4.2 ; U4.2 20.72,10.12 18.22,10.14 R13.1 17.39,9.32 7.28,9.32 7.05,9.59 4.94,9.58 v1(4,10.04) ; C7.1 1.09,28.54 1.09,27.95 2.24,27.95 v1(2.59,28.29) 2.85,28.57 2.85,28.76 2.92,28.82 ; v1(4.28,27.9) 4.96,27.9 5.35,28.3 5.35,28.58
  Bottom Layer w0.127: v1(4.28,27.9) 3.48,26.72 3.48,22.91 v1(4.37,22.03) 3.15,20.81 3.15,18.91 4.25,18.91 4.25,17.34 3.91,17.16 3.1,17.2 3.12,15.45 4.05,15.44 4.05,14.66 4.21,14.5 4.21,13.24 3.59,12.62 3.59,10.45 v1(4,10.04) 3.89,9.93 3.89,9.58 3.93,9.55 3.93,7.69 3.77,7.53 3.77,6.12 4.76,6.12 4.89,6 4.89,3.11 v1(4.95,3.05) ; v1(4.28,27.9) 4.34,27.85 ; v1(4.28,27.9) 3.99,28.19 2.69,28.19 v1(2.59,28.29) ; v1(10.8,2.67) 10.67,2.79 10.67,4.57 v1(10.54,4.7)
VCC_3V3: length 60.2
  Top Layer w0.127: 2.42,30.35 2.42,30.23 2.84,29.85 3.06,30.1 3.4,30.1 3.61,29.89 ; 2.42,30.35 3.89,30.35 4.14,30.1 5.24,30.1 5.24,29.83 C9.1 ; 2.42,30.35 v1(2.37,30.41) ; 1.51,25.4 1.21,25.4 NOREF.2 ; 1.51,25.4 1.51,25.97 1.58,25.97 ; 1.51,25.4 1.51,24.59 ; 3.63,32.17 3.28,32.36 2.63,32.36 2.31,32.01 ; 2.31,32.55 2.22,32.64 1.34,32.64 1.21,32.51 1.09,32.51 C13.1 ; 2.31,32.55 2.31,32.01 ; 2.31,32.55 2.47,32.7 5.47,32.7 5.9,32.27 C14.1 ; 1.58,25.97 3.21,25.97 3.45,25.72 5.48,25.72 ; 1.58,25.97 1.58,26.22 1.27,26.53 v1(1.27,27.31) 1.14,27.18 0.74,27.18 0.61,27.31 0.61,29.71 0.63,29.72 C10.1 ; R1.2 7.03,24.99 6.78,25.24 v1(6.78,25.6) 5.6,25.6 5.48,25.72 ; 2.31,32.01 2.25,31.95 v1(2.25,31.59) ; C3.1 5.61,25.85 5.48,25.72 ; v1(8.01,24.41) 8.68,24.41 U1.3 9.09,24.3 10.05,25.15 10.07,25.46 v1(10.07,25.46) ; 3.58,25.4 3.58,25.65
  Bottom Layer w0.127: C18.1 16.36,26.29 15.64,26.3 15.62,24.8 15.59,24.78 14.14,24.78 13.72,25.19 ; v1(8.01,24.41) 7.97,24.41 v1(6.78,25.6) ; 13.72,25.19 13.14,28.06 12.69,28.92 10.07,28.92 v1(10.07,25.46) 10.07,23.13 9.94,23 L1.2 ; 13.72,25.19 13.53,23.91 14.42,22.77 16.17,22.77 R10.2 ; v1(1.27,27.31) 1.27,29.31 v1(2.37,30.41) 2.25,30.53 v1(2.25,31.59)
VIN: length 86.9
  Top Layer w0.127: 20.52,7.62 20.74,7.4 20.74,7.37 v1(21.7,6.41)
  Top Layer w0.254: 23.14,7.64 23.12,7.62 20.52,7.62
  Bottom Layer w0.127: R9.1 15.99,26.91 15.41,26.62 U5.4 ; 16.11,27.06 16.11,27.99 14.6,29.36 11.81,29.36 9.6,31.58 7.42,31.58 v1(7.17,31.82) 6.75,32.25 1.54,32.25 0.4,31.11 0.44,14.51 0.64,14.32 ; C17.2 23.06,6.86 v1(21.7,6.41) ; 3.57,1.77 3.94,1.4 20.33,1.54 21.7,2.91 v1(21.7,6.41) ; 3.57,1.77 3.58,3.47 2.91,3.47 0.41,5.98 0.41,11.2 0.67,11.46 2.16,11.46 2.16,12.83 1.96,13.03 v1(1.96,13.47) 1.7,13.47 0.85,14.32 0.64,14.32 ; 3.57,1.77 3.57,1.77 ; C15.1 0.64,13.65 0.64,14.32 ; C16.2 v1(21.7,6.41)
BOTON: length 2.6
  Top Layer w0.127: U1.7 7.17,20.68 6.55,20.68 6.47,20.61 6.61,20.47 NOREF#2.1
DATA_+_USB: length 12
  Top Layer w0.127: U1.23 15.75,14.23 v1(15.74,14.23)
  Bottom Layer w0.127: v1(15.74,14.23) 17.91,14.26 18.29,15.26 18.29,19.04 18.45,19.21 19.38,19.21 20.74,17.26 21.01,17.21
DATA_-_USB: length 11.5
  Top Layer w0.127: v1(16.6,15.69) U1.24
  Bottom Layer w0.127: 21.02,19 20.26,19.77 16.6,19.77 v1(16.6,15.69)
INFRA: length 11.6
  Top Layer w0.127: 3.27,18.7 5.07,19.84 5.09,21.14 4.99,21.25 ; 4.99,21.25 4.73,21.51 2.22,21.51 v1(2.11,21.39) 1.51,21.99 R12.1 ; 4.99,21.25 7.43,21.25 v1(7.48,21.34) U1.6
IO10/XMCLK: length 9.9
  Top Layer w0.127: v1(10.38,7.64) 9.87,7.13 9.87,6.01 FPC1.13 ; v1(9.53,11.05) 9.79,11.32 10.85,11.32 11.09,11.56 11.09,12.29 11.69,12.29 12.35,12.95 U1.19
  Bottom Layer w0.127: v1(9.53,11.05) 9.53,9.24 10.38,8.38 v1(10.38,7.64)
IO11/CVP_Y8: length 15.7
  Top Layer w0.127: v1(15.75,11.81) 14.77,11.81 14.05,12.53 U1.21 ; v1(15.75,7.87) 15.75,7.91 15.25,8.41 13.41,8.41 13.28,8.29 13.28,8.17 9.74,8.17 v1(9.53,8.38) ; FPC1.14 9.27,5.93 9.27,7.4 v1(9.45,7.58)
  Bottom Layer w0.127: v1(15.75,11.81) v1(15.75,7.87) ; v1(9.53,8.38) 9.45,8.31 v1(9.45,7.58)
IO12/DVP_Y7: length 19.8
  Top Layer w0.127: v1(6.75,8.68) 6.77,8.66 8.36,8.66 8.36,6 FPC1.16 ; v1(6.86,14.38) 7.03,14.55 14.82,14.55 15.03,14.35 15.03,13.17 U1.22
  Bottom Layer w0.127: v1(6.86,14.38) 6.75,14.27 v1(6.75,8.68)
IO13/DVP_PCLK: length 12.7
  Top Layer w0.127: v1(8.25,4.57) 7.78,5.05 FPC1.17 ; U1.17 10.52,12.91 10.52,11.58 8.49,11.58 v1(8.25,11.81)
  Bottom Layer w0.127: v1(8.25,11.81) 8.33,11.74 8.33,4.65 v1(8.25,4.57)
IO14/DVP_Y6: length 10.7
  Top Layer w0.127: v1(7.79,10.89) 8.15,10.53 10.12,10.53 10.12,10.72 10.19,10.8 v1(10.41,10.8) ; v1(9.78,12.19) 9.8,12.21 U1.16 ; FPC1.18 7.31,5.95 7.31,6.58 7.43,6.7 7.43,7.07 7.8,7.43 v1(7.8,8.12)
  Bottom Layer w0.127: v1(7.8,8.12) 7.79,8.13 v1(7.79,10.89) ; v1(10.41,10.8) 10.41,11.56 v1(9.78,12.19)
IO15/DVP_Y2: length 9.6
  Top Layer w0.127: v1(7.49,13.72) 7.73,13.95 7.91,13.95 8.04,14.08 8.74,14.08 U1.15 ; FPC1.19 6.83,5.97 6.83,7.34 v1(6.99,7.49)
  Bottom Layer w0.127: v1(6.99,7.49) 7.21,7.72 7.21,8.18 7.3,8.27 7.3,9.02 7.21,9.11 7.21,13.43 v1(7.49,13.72)
IO16/DVP_Y5: length 17.2
  Top Layer w0.127: v1(3.39,8.13) 3.88,7.63 6.28,7.63 6.46,7.46 6.46,6.7 6.34,6.58 6.34,5.98 FPC1.20 ; U1.14 8.73,14.92 v1(3.48,14.92)
  Bottom Layer w0.127: v1(3.39,8.13) 3.3,8.21 3.3,14.74 v1(3.48,14.92)
IO17/DVP_Y3: length 12.5
  Top Layer w0.127: 5.73,7.11 5.91,7.11 5.8,7 5.8,6.75 5.85,6.7 5.85,5.99 ; U1.13 8.65,15.69 6.67,15.69 v1(6.6,15.62)
  Bottom Layer w0.127: v1(6.6,15.62) 6.58,15.62 6.35,15.39 6.35,15.18 6.33,15.15 6.42,9.35 6.23,9.18 6.23,7.4 v1(5.93,7.11)
IO18/DVP_Y4: length 15.3
  Top Layer w0.127: FPC1.22 5.18,6.03 5.18,6.85 5.2,6.88 ; v1(5.18,6.97) 5.18,6.96 5.18,6.91 ; U1.12 7.84,16.67 7.6,16.91 6.23,16.91 6,17.15 v1(6,17.37)
  Bottom Layer w0.127: v1(6,17.37) 5.98,17.35 5.98,10.58 5.64,9.21 5.06,9.2 5.06,7.27 5.18,7.14 v1(5.18,6.97)
IO38/DVP_VSYNC: length 19.4
  Top Layer w0.127: v1(12.32,15.49) v1(14.35,15.49) ; v1(12.07,18.16) 11.86,18.37 U1.10 ; 12.8,5.94 12.8,7.05 13.53,7.78 14.47,7.78 v1(14.53,7.72)
  Bottom Layer w0.127: v1(14.53,7.72) 14.73,7.93 14.73,15.11 v1(14.35,15.49) ; v1(12.32,15.49) 12.32,17.91 v1(12.06,18.16)
IO39/CAM_SCL: length 35.4
  Top Layer w0.127: v1(2.73,23.85) 2.47,23.59 R5.1 ; v1(3.66,17.7) 3.8,17.84 5.28,17.84 5.59,18.15 6.44,18.15 v1(7.43,19.14) 8.69,19.14 U1.9 ; v1(9.78,4.19) 9.83,4.14 11.82,4.14 12.18,4.5 12.18,4.87 13.77,4.87 13.77,5.91 FPC1.5
  Bottom Layer w0.127: v1(3.66,17.7) 2.87,18.49 2.87,23.71 v1(2.73,23.85) ; v1(7.43,19.14) 7.43,16.21 8.9,14.75 8.9,6.83 9.26,6.83 9.5,6.59 9.5,4.47 v1(9.78,4.19)
IO40/CAM_SDA: length 28.2
  Top Layer w0.127: v1(6.29,22.05) 5.59,22.05 5.09,22.55 R6.1 ; v1(10.36,20.11) 8.77,20.11 ; 8.77,20.11 U1.8 ; 8.77,20.11 8.1,20.11 7.67,19.68 6.97,19.68 6.48,19.19 v1(6.31,19.19) ; v1(10.36,16.21) 10.44,16.13 v1(15.11,16.13) ; FPC1.3 14.78,6.91 v1(14.86,6.98)
  Bottom Layer w0.127: v1(14.86,6.98) 15.11,7.24 v1(15.11,16.13) ; v1(6.29,22.05) 6.63,21.72 6.63,19.7 6.43,19.49 6.43,19.31 v1(6.31,19.19) ; v1(10.36,16.21) v1(10.36,20.11)
IO47/DVP_HREF: length 14
  Top Layer w0.127: v1(11.6,7.6) 11.6,6.8 11.69,6.71 11.69,6.01 FPC1.9 ; v1(11.58,16.7) 10.76,17.52 U1.11
  Bottom Layer w0.127: v1(11.58,16.7) 11.6,16.68 v1(11.6,7.6)
IO48/DVP_Y9: length 17.1
  Top Layer w0.127: v1(13.46,11.94) 13.2,12.2 U1.20 ; v1(13.59,3.81) 13.3,3.52 9.26,3.52 9.26,4.75 9.58,4.75 9.78,4.95 10.03,4.95 10.29,5.21 FPC1.12
  Bottom Layer w0.127: v1(13.59,3.81) 13.41,3.99 13.41,11.89 v1(13.46,11.94)
RESET: length 3
  Top Layer w0.127: v1(21.52,25.97) U1.45
  Bottom Layer w0.127: 20.59,24.47 v1(21.52,25.97)
VIBRADOR: length 23.7
  Top Layer w0.127: NOREF#5.2 0.85,7.05 0.82,7.08 0.82,7.82 1.08,8.07 v1(1.08,8.15) ; v1(7.95,23.47) 7.99,23.51 8.73,23.51 U1.4 ; v1(2.27,15.28) 3.37,16.38 v1(6.86,16.38)
  Bottom Layer w0.127: 7.95,23.47 6.98,23.47 6.91,23.4 6.91,16.44 v1(6.86,16.38) ; v1(1.08,8.15) 1.62,8.15 2.54,9.07 2.54,15 v1(2.27,15.28)
$1N1431: length 26.3
  Top Layer w0.127: v1(4.37,7.01) 4.28,6.92 FPC1.24 ; 22.31,11.09 20.72,11.09 C2.1 ; 22.31,11.09 22.75,11.09 C1.1 ; 22.31,11.09 22.65,10.75 U4.1 ; v1(4.56,10.88) 4.77,11.08 5.42,11.08 6,10.5 7.28,10.51 7.58,10.21 13.41,10.23 13.75,10.57 20.23,10.59 20.72,11.09
  Bottom Layer w0.127: v1(4.56,10.88) 4.53,10.84 4.53,9.53 4.18,9.19 4.18,7.68 4.52,7.34 4.52,7.16 v1(4.37,7.01)
$1N1711: length 32.2
  Top Layer w0.127: R1.1 6.11,24.31 v1(6.11,23.81) 5.59,23.81 5.06,24.34 C5.1 ; v1(13.97,9.85) 13.82,9.71 7.47,9.71 7.08,10.1 v1(5.11,10.1) ; FPC1.6 13.28,6.8 13.59,7.11 v1(13.97,7.11)
  Bottom Layer w0.127: v1(13.97,7.11) 13.97,7.12 v1(13.97,9.85) ; v1(6.11,23.81) 6.11,23.83 5.78,23.83 5.62,23.66 5.61,21.66 6.33,21.29 6.37,20.06 5.56,19.31 5.56,18.02 5.47,17.93 5.53,13.99 4.15,12.61 4.15,12.43 5.09,11.5 5.09,10.13 v1(5.11,10.1)
$1N1779: length 11.5
  Top Layer w0.127: v1(12.21,7.03) 12.21,6 FPC1.8 ; v1(12.31,11.33) 12.44,11.21 17.82,11.23 17.82,11.29 R2.2
  Bottom Layer w0.127: v1(12.31,11.33) 12.18,11.21 12.18,7.05 v1(12.21,7.03)
$1N2040: length 7.7
  Top Layer w0.127: R4.1 2.67,23.19 ; 2.67,23.19 1,23.19 R5.2 1.09,24.19 1.04,24.25 R3.1 ; 2.67,23.19 2.95,23.19 3.29,23.53 5.48,23.53 5.48,22.95 5.58,22.86
$1N3684: length 0.9
  Top Layer w0.127: U1.1 U1.2
$1N9477: length 45.1
  Top Layer w0.127: 1.7,9.84 2.51,10.1 2.51,11.48 1.31,12.62 1.31,15.96 v1(1.16,16.11)
  Top Layer w0.254: v1(21.08,3.81) 20.74,4.59 20.74,5.08 23.12,5.08 23.14,5.1
  Bottom Layer w0.127: v1(21.08,3.81) 19.94,3.81 19.3,3.17 18.54,3.17 17.4,2.03 4.19,2.03 4.19,4.7 2.86,6.04 2.86,16.09 2.83,16.11 v1(1.16,16.11)
$1N11625: length 6.9
  Top Layer w0.127: v1(10.86,24.53) 10.86,25.1 v1(11.96,26.21)
  Bottom Layer w0.127: v1(11.96,26.21) 11.96,26.02 12.29,25.69 U5.3 ; v1(10.86,24.53) 10.83,22.29 9.74,21.2 L1.1
$1N11783: length 3.6
  Bottom Layer w0.127: U5.5 15.28,23.95 16.01,23.95 R10.1 16.21,23.82 16.21,24.79 ; 16.21,24.79 R11.2 ; 16.21,24.79 16.21,25.71 C18.2
$1N15264: length 1.5
  Top Layer w0.127: Q1.3 0.93,19.33 0.93,18.37 NOREF#3.1
$1N23339: length 42.1
  Top Layer w0.254: v1(2.52,16.77) 1.6,15.52 1.74,14.82 2.2,14.35 2.53,14.35 2.99,13.89 3.27,11.82 2.76,9.92 2.8,6.09 0.43,3.16 0.43,1.02 19.12,1.02 20.64,2.54 23.12,2.54 23.14,2.56
  Bottom Layer w0.254: CHARGER1.1 v1(2.52,16.77)

## Copper pours and planes (outline as drawn; the poured copper is in the pictures)
GND on Bottom Layer: 20.35,16.09 21.75,16.09 21.75,14.84 20.35,14.84
(no net) on Top Layer: 20.34,21.58 21.77,21.58 21.77,20.15 20.34,20.15
(no net) on Bottom Layer: 21.77,20.93 21.74,21.07 21.69,21.2 21.61,21.32 21.51,21.42 21.39,21.5 21.26,21.55 21.12,21.58 20.98,21.58 20.85,21.55 20.72,21.5 20.6,21.42 20.5,21.32 20.42,21.2 20.37,21.07 20.34,20.93 20.34,20.79 20.37,20.66 20.42,20.53 20.5,20.41 20.6,20.31 20.72,20.23 20.85,20.18 20.98,20.15 21.12,20.15 21.26,20.18 21.39,20.23 21.51,20.31 21.61,20.41 21.69,20.53 21.74,20.66 21.77,20.79
DATA_+_USB on Bottom Layer: 21.76,17.26 21.73,17.4 21.68,17.53 21.6,17.65 21.5,17.75 21.38,17.83 21.25,17.88 21.11,17.91 20.97,17.91 20.83,17.88 20.7,17.83 20.59,17.75 20.49,17.65 20.41,17.53 20.36,17.4 20.33,17.26 20.33,17.12 20.36,16.98 20.41,16.85 20.49,16.74 20.59,16.64 20.7,16.56 20.83,16.51 20.97,16.48 21.11,16.48 21.25,16.51 21.38,16.56 21.5,16.64 21.6,16.74 21.68,16.85 21.73,16.98 21.76,17.12
DATA_-_USB on Bottom Layer: 21.75,19.06 21.72,19.2 21.66,19.33 21.59,19.45 21.49,19.55 21.37,19.62 21.24,19.68 21.1,19.71 20.96,19.71 20.82,19.68 20.69,19.62 20.58,19.55 20.48,19.45 20.4,19.33 20.34,19.2 20.32,19.06 20.32,18.92 20.34,18.78 20.4,18.65 20.48,18.54 20.58,18.44 20.69,18.36 20.82,18.3 20.96,18.28 21.1,18.28 21.24,18.3 21.37,18.36 21.49,18.44 21.59,18.54 21.66,18.65 21.72,18.78 21.75,18.92
RESET on Bottom Layer: 21.3,24.57 21.27,24.7 21.22,24.83 21.14,24.95 21.04,25.05 20.92,25.13 20.79,25.18 20.65,25.21 20.51,25.21 20.38,25.18 20.25,25.13 20.13,25.05 20.03,24.95 19.95,24.83 19.9,24.7 19.87,24.57 19.87,24.42 19.9,24.29 19.95,24.16 20.03,24.04 20.13,23.94 20.25,23.86 20.38,23.81 20.51,23.78 20.65,23.78 20.79,23.81 20.92,23.86 21.04,23.94 21.14,24.04 21.22,24.16 21.27,24.29 21.3,24.42

## Text on the board
Bottom Silkscreen Layer: RESET | USB   D-  D+  GND | CAMERA / Joao Miranda / Magic / v1.0
Top Silkscreen Layer: 3,3v | BUTTON | INFRA | VIBRADOR
